# Altium project AP63300.PrjPcb
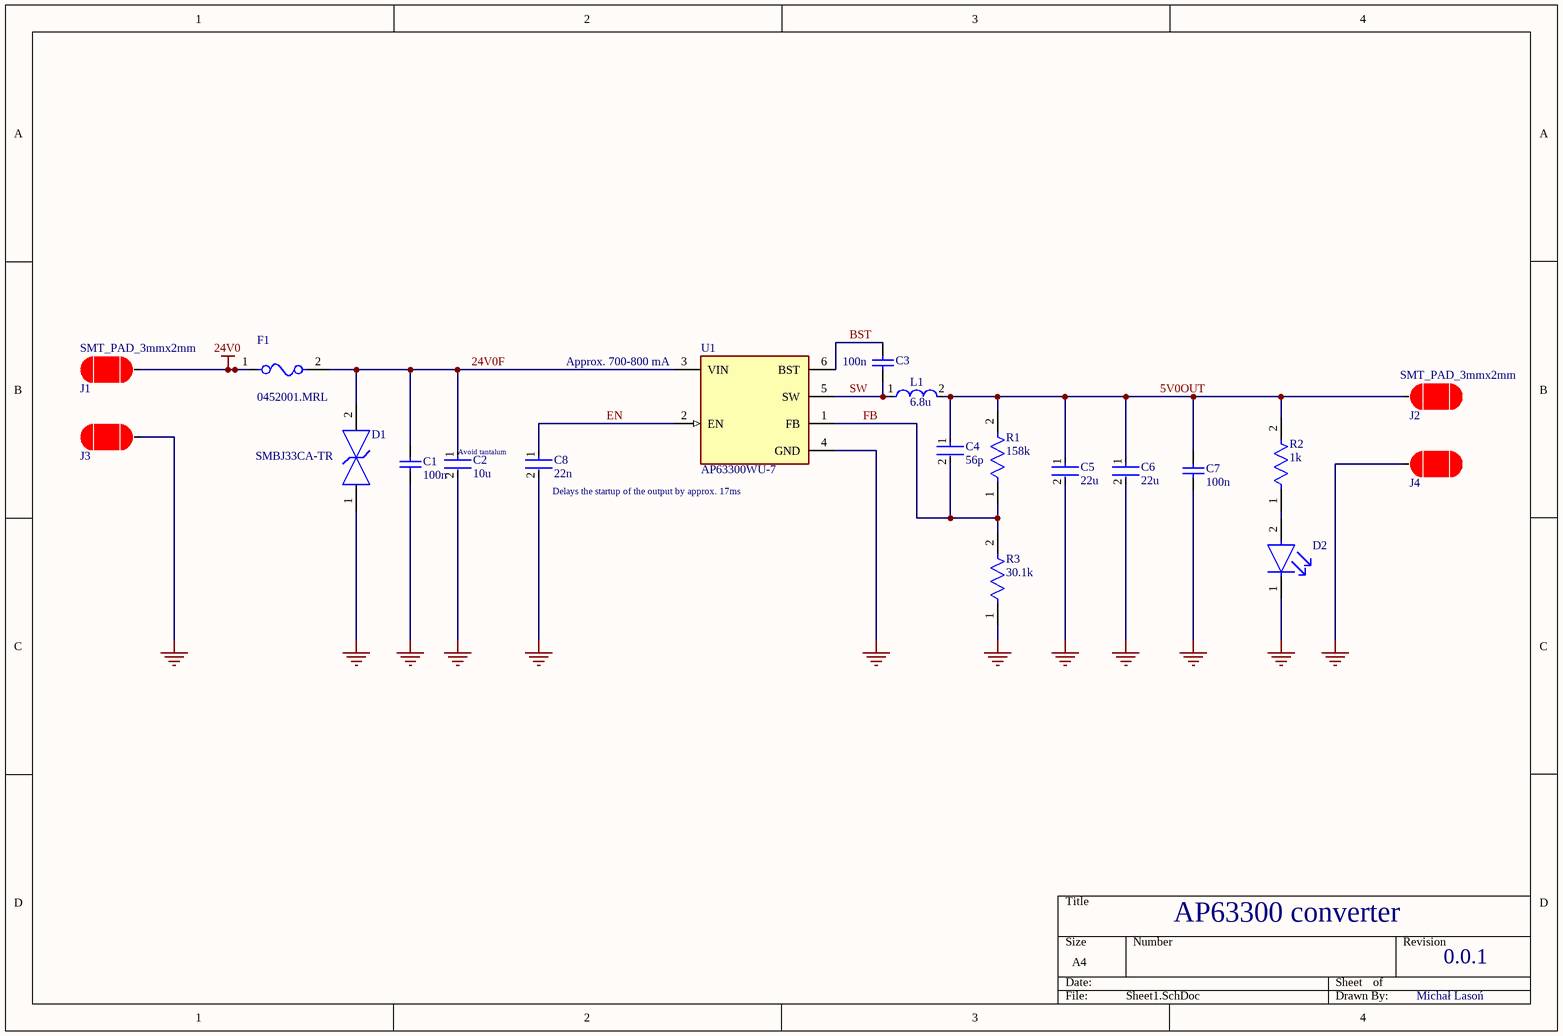
[diagram p0: Sheet1.SchDoc]
1 sheet, 20 parts. Net scope: global (net labels, ports and power ports of the same name join across sheets).
Board file: PCB1.PcbDoc

## Sheet Sheet1.SchDoc
size A4; SheetNumber: 1; SheetTotal: 1

### Parts
C1  100n  [CAPC2013X140X50NL20T25]
C2  10u  [FP-C3225-250-0_4-IPC_B]
C3  100n  [CAPC2013X140X50NL20T25]
C4  56p  [FP-C0805C-DN-MFG]
C5  22u  [FP-1210-L_3_3_0_4-W_2_5_0-IPC_A]
C6  22u  [FP-1210-L_3_3_0_4-W_2_5_0-IPC_A]
C7  100n  [CAPC2013X140X50NL20T25]
C8  22n  [FP-C0805C-DN-MFG]
D1  SMBJ33CA-TR  [FP-SMB-CA-MFG]
D2  HSMS-C170  [FP-HSMS-C170-MFG]  (value not drawn)
F1  0452001.MRL  [FP-0452-MFG]
J1  SMT_PAD_3mmx2mm  [SMT_PAD_3mmx2mm]
J2  SMT_PAD_3mmx2mm  [SMT_PAD_3mmx2mm]
J3  SMT_PAD_3mmx2mm  [SMT_PAD_3mmx2mm]  (value not drawn)
J4  SMT_PAD_3mmx2mm  [SMT_PAD_3mmx2mm]  (value not drawn)
L1  6.8u  [FP-IHLP-2525CZ-FP_2_413x3-MFG]
R1  158k  [FP-CRCW0805-e3-MFG]
R2  1k  [FP-CR0805-IPC_B]
R3  30.1k  [FP-CRCW0805-e3-IPC_C]
U1  AP63300WU-7  [FP-TSOT26-IPC_A]

### Nets
24V0: F1.1 J1.0
GND: C1.1 C2.2 C5.2 C6.2 C7.1 C8.2 D1.1 D2.1(C) J3.0 J4.0 R3.1 U1.4(GND)
5V0OUT: C4.1 C5.1 C6.1 C7.2 J2.0 L1.2 R1.2 R2.2
24V0F: C1.2 C2.1 D1.2 F1.2 U1.3(VIN)
BST: C3.2 U1.6(BST)
EN: C8.1 U1.2(EN)
FB: C4.2 R1.1 R3.2 U1.1(FB)
SW: C3.1 L1.1 U1.5(SW)
NetD2_2: D2.2(A) R2.1

### Notes on the sheet
- (near U1) Approx. 700-800 mA
- (near C2) Avoid tantalum
- Delays the startup of the output by approx. 17ms
- AP63300 converter
- 0.0.1
- Michał Lasoń

### Library data of the parts
C1 C3 C7 = CMP-2007-04629-1: Part Number: 08055C104K4Z2A; Manufacturer: AVX Interconnect / Elco
C2 = CMP-08246-002749-1: Multilayer Ceramic Capacitors 10uF ±10% 50V X5R SMD 1210; Thickness: 0.11inch; Depth: 2.5mm; RoHS Compliant: Yes; Case/Package: 1210; Package Quantity: 1; Capacitance: 10uF; Max Operating Temperature: 85°C; Mount: Surface Mount; Case Code (Metric): 3225; Lead Free: Lead Free; Height: 2.5mm; Packaging: Tape and Reel; Resistor Type: Ceramic; Series: C; Weight: 0.000564oz; Voltage Rating: 50V; Dielectric: X5R; Length: 3.2mm; Tolerance: 10%; Termination: SMD/SMT; Dielectric Material: Ceramic; Case Code (Imperial): 1210; Min Operating Temperature: -55°C; Voltage Rating (DC): 50V; Width: 0.098inch
C4 = CMP-2007-00050-2: CAP CER 56PF 50V C0G/NP0 0805; Manufacturer: KEMET; Manufacturer Part Number: C0805C560J5GACTU; Material: Ceramic; Tolerance: 0.05; Temperature Characteristic: C0G; Temperature Coefficient: 30ppm/°C; Capacitance: 56 pF; Height: 0.88mm; RoHS: TRUE; Category: Cap; Voltage Rating: 50 V; Lead Free: Yes; Device Class L2: Capacitors; Value: 56 pF; Ipc Land Pattern Name: CAPC200125X78; Octopart: https://octopart.com/c0805c560j5gactu-kemet-93783; Device Class L1: Passive Components; Automotive: No; Temperature: -55°C to +125°C; Digikey Description: CAP CER 56PF 50V C0G/NP0 0805; ComponentLink2URL: https://content.kemet.com/datasheets/KEM_C1003_C0G_SMD.pdf; Temperature Range High: +125°C; Mouser Description: 0805 C 56pF Ceramic Multilayer Capacitor, 50 VDC, +125degC, C0G Dielec, +/-5%; ComponentLink2Description: Datasheet; Device Class L3: Ceramic Capacitors; Temperature Range Low: -55°C; Package: C0805C-DN
C5 C6 = CMP-1038-02285-3: General Purpose Ceramic Capacitor, 1210, 22uF, 20%, X5R, 15%, 25V; Dissipation Factor: 12.5%; Insulation Resistance: 10GR; Dielectric Material: Ceramic; Case/Package: 1210; Width: 2.5mm; Construction: Flat; Number of Pins: 2; Max Operating Temperature: 85°C; Dielectric: X5R; Voltage Rating (DC): 25V; Contact Plating: Tin; Min Operating Temperature: -55°C; Capacitance: 22uF; Voltage Rating: 25V; Case Code (Imperial): 1210; Lead Free: Lead Free; Mount: Surface Mount; Series: -; Package Quantity: 1; Case Code (Metric): 3225; Height: 2.79mm; Depth: 2.5mm; REACH SVHC: No SVHC; RoHS Compliant: Yes; Radiation Hardening: No; Packaging: Tape and Reel; Length: 3.2mm; Termination: SMD/SMT; Voltage: 25V; Thickness: 0.11inch; Tolerance: 20%
C8 = CMP-2007-00338-2: CAP CER 0.022UF 50V X7R 0805; Manufacturer: KEMET; Manufacturer Part Number: C0805C223K5RACTU; Value: 22nF; Material: Ceramic; Tolerance: 0.1; Temperature Coefficient: 30ppm/°C; Automotive: No; Package: C0805C-DN; RoHS: TRUE; Height: 0.88mm; Lead Free: Yes; Temperature Range Low: -55°C; Digikey Description: CAP CER 0.022UF 50V X7R 0805; ComponentLink2Description: Datasheet; Capacitance: 22nF; Mouser Description: Capacitor; Ceramic; Cap; .022uF; Tol 10%; SMT; Vol-Rtg 50V; X7R; Tape and Reel; Device Class L3: Ceramic Capacitors; Category: Cap; Voltage Rating: 50 V; Temperature Characteristic: X7R; Ipc Land Pattern Name: CAPC200125X78; Octopart: https://octopart.com/c0805c223k5ractu-kemet-145968; Device Class L1: Passive Components; Temperature: -55°C to +125°C; ComponentLink2URL: https://content.kemet.com/datasheets/KEM_C1003_C0G_SMD.pdf; Temperature Range High: +125°C; Device Class L2: Capacitors
D1 = CMP-12225-000040-1: TVS DIODE 33V 69.7V SMB; Manufacturer: STMicroelectronics; Direction: Bidirectional; Peak Pulse Current: 11.8A; Peak Pulse Power: 600W; Clamping Voltage: 53.3V; Breakdown Voltage: 36.7V; Number Of Channels: 1; Standoff Height: 0.05mm; Max Junction Temp: +150°C; Lead Free: Yes; Device Class L1: Circuit Protection; Device Class L3: unset; Mouser Description: TVS Diodes - Transient Voltage Suppressors 600W 33V Bidirect; Device Class L2: TVS Diodes; Temperature Range High: +150°C; Temperature: -55°C to +150°C; Temperature Range Low: -55°C; Octopart: https://octopart.com/smbj33ca-tr-stmicroelectronics-347069; Manufacturer Part Number: SMBJ33CA-TR; Automotive: No; ComponentLink2URL: https://www.st.com/resource/en/datasheet/smbj.pdf; RoHS: TRUE; Package: SMB-CA; Category: Diode; ComponentLink2Description: Datasheet; Height: 2.65mm; Reverse Standoff Voltage: 33V; Digikey Description: TVS DIODE 33V 69.7V SMB
D2 = CMP-18399-000018-1: LED RED DIFFUSED CHIP SMD; Forward Voltage: 2.1V; Shape: Rectangular; Wavelength: 626nm; Power Dissipation: 52mW; Reverse Voltage: 5V; Number of Elements: 1; Lens Color: White; Viewing Angle: 170°; Test Current: 20mA; Luminous Intensity: 10mcd; Number of Terminals: 2; Lead Free: Lead Free; Min Operating Temperature: -40°C; Package Quantity: 1; Depth: 1.25mm; Color: Red; Lens Style: Diffused; Mount: Surface Mount; Length: 2mm; Dominant Wavelength: 626nm; Packaging: Tape and Reel; Case Code (Metric): 2012; Max Operating Temperature: 85°C; Case Code (Imperial): 0805; Case/Package: 0805; Height: 0.8mm; Number of LEDs: 1; Illumination Color: Red; Width: 1.25mm; Radiation Hardening: No; Power Rating: 52mW; REACH SVHC: No SVHC; Number of Pins: 2; Lens Transparency: Diffused; Forward Current: 20mA
F1 = CMP-08605-000042-1: FUSE BRD MNT 1A 125VAC/VDC 2SMD; Manufacturer: Littelfuse Inc; Fuse I2T: 1.98A2Sec; Max Fuse Ac Voltage: 125V; Resistance: 0.225Ω; Fuse Interrupt Ac Current: 50A; Fuse Interrupt Dc Current: 300A; Value: 0.225Ω; Fuse Blow Speed: Slow; Temperature: -55°C to +125°C; Temperature Range High: +125°C; Package: 0452; ComponentLink2URL: https://www.littelfuse.com/~/media/electronics/datasheets/fuses/littelfuse_fuse_452_454_datasheet.pdf.pdf; Max Fuse Dc Voltage: 125V; Temperature Range Low: -55°C; Device Class L2: Fuses; Mouser Description: Surface Mount Fuses 125V 1A; Device Class L3: unset; ComponentLink2Description: Datasheet; Device Class L1: Circuit Protection; Fuse Current: 1A; Automotive: No; Digikey Description: FUSE BRD MNT 1A 125VAC/VDC 2SMD; Height: 2.94mm; Category: Fuse; Octopart: https://octopart.com/0452001.mrl-littelfuse-566112; Manufacturer Part Number: 0452001.MRL; Voltage Rating: 125V; Lead Free: Yes; RoHS: TRUE
L1 = CMP-02424-000104-1: Commercial Inductors, High Saturation Series 6.8uH 4.5A 60mΩ 20%; Saturation Current: 8A; Self Resonant Frequency: 5MHz; Core Material: Metal; DC Resistance (DCR): 60mR; Test Frequency: 100kHz; Shielding: Shielded; Number of Pins: 2; Tolerance: 20%; Max DC Current: 8A; Max Operating Temperature: 125°C; Radiation Hardening: No; Inductance: 6.8uH; Contact Plating: Tin; RMS Current (Irms): 4.5A; Case/Package: 2525; Inductance Tolerance: 20%; Case Code (Metric): 6363; Lead Free: Lead Free; Package Quantity: 2000; Current Rating: 4.5A; Case Code (Imperial): 2525; Height - Seated (Max): 0.118inch; Height: 3mm; Mount: Surface Mount; Depth: 6.72mm; Military Standard: Not; Packaging: Tape and Reel; Min Operating Temperature: -55°C; Width: 0.255inch; Length: 7.24mm; Termination: SMD/SMT
R1 = CMP-1013-00756-3: RES Thick Film, 158kΩ, 1%, 0.125W, 100ppm/°C, 0805; Voltage Rating: 150V; Resistance: 158kR; Max Power Dissipation: 125mW; Packaging: Tape and Reel; Tolerance: 1%; Case Code (Imperial): 0805; Voltage Rating (DC): 150V; Case/Package: 0805; Number of Pins: 2; Termination: SMD/SMT; Width: 0.049inch; Package Quantity: 10; Max Operating Temperature: 155°C; Contact Plating: Tin; Min Operating Temperature: -55°C; Case Code (Metric): 2012; Radiation Hardening: No; Features: Automotive AEC-Q200; Height: 0.02inch; Depth: 1.25mm; Number of Terminations: 2; Lead Free: Lead Free; Power Rating: 125mW; Length: 2mm; Composition: Thick Film; Temperature Coefficient: 100ppm/°C; Weight: 0.000194oz; Military Standard: Not
R2 = CMP-07231-005482-1: Thick Film Chip Resistors 0805 1kΩ 0.125W 1% 100ppm/°C; Max Power Dissipation: 125mW; Voltage Rating: 150V; Resistance: 1kR; Package Quantity: 1; Contact Plating: Tin; Length: 2mm; Number of Terminations: 2; Max Operating Temperature: 155°C; Depth: 1.25mm; REACH SVHC: No SVHC; Case Code (Imperial): 0805; Termination: SMD/SMT; Min Operating Temperature: -55°C; Case Code (Metric): 2012; Width: 1.25mm; Packaging: Tape and Reel; Case/Package: 0805; Height: 0.5mm; Radiation Hardening: No; Thickness: 508um; Temperature Coefficient: 100ppm/°C; Mount: Surface Mount; Features: Moisture Resistant; Voltage Rating (DC): 150V; Composition: Thick Film; Power Rating: 125mW; Number of Pins: 2; Tolerance: 1%
R3 = CMP-1013-00676-3: RES Thick Film, 30.1kΩ, 1%, 0.125W, 100ppm/°C, 0805; Power Rating: 125mW; Voltage Rating: 150V; Resistance: 30.1kR; Max Operating Temperature: 155°C; Composition: Thick Film; Termination: SMD/SMT; Case Code (Imperial): 0805; Packaging: Tape and Reel; Tolerance: 1%; Number of Terminations: 2; Temperature Coefficient: 100ppm/°C; Radiation Hardening: No; Width: 1.25mm; Features: Automotive AEC-Q200; Contact Plating: Tin; Military Standard: Not; Package Quantity: 10; Weight: 0.000194oz; Case/Package: 0805; Min Operating Temperature: -55°C; Lead Free: Lead Free; Height: 0.45mm; Depth: 1.25mm; Mount: Surface Mount; Max Power Dissipation: 125mW; Length: 2mm; Voltage Rating (DC): 150V; Case Code (Metric): 2012
U1 = CMP-12757-000025-1: DCDC CONV HV BUCK TSOT26